# Altium project ALU_Ctrl.PrjPcb
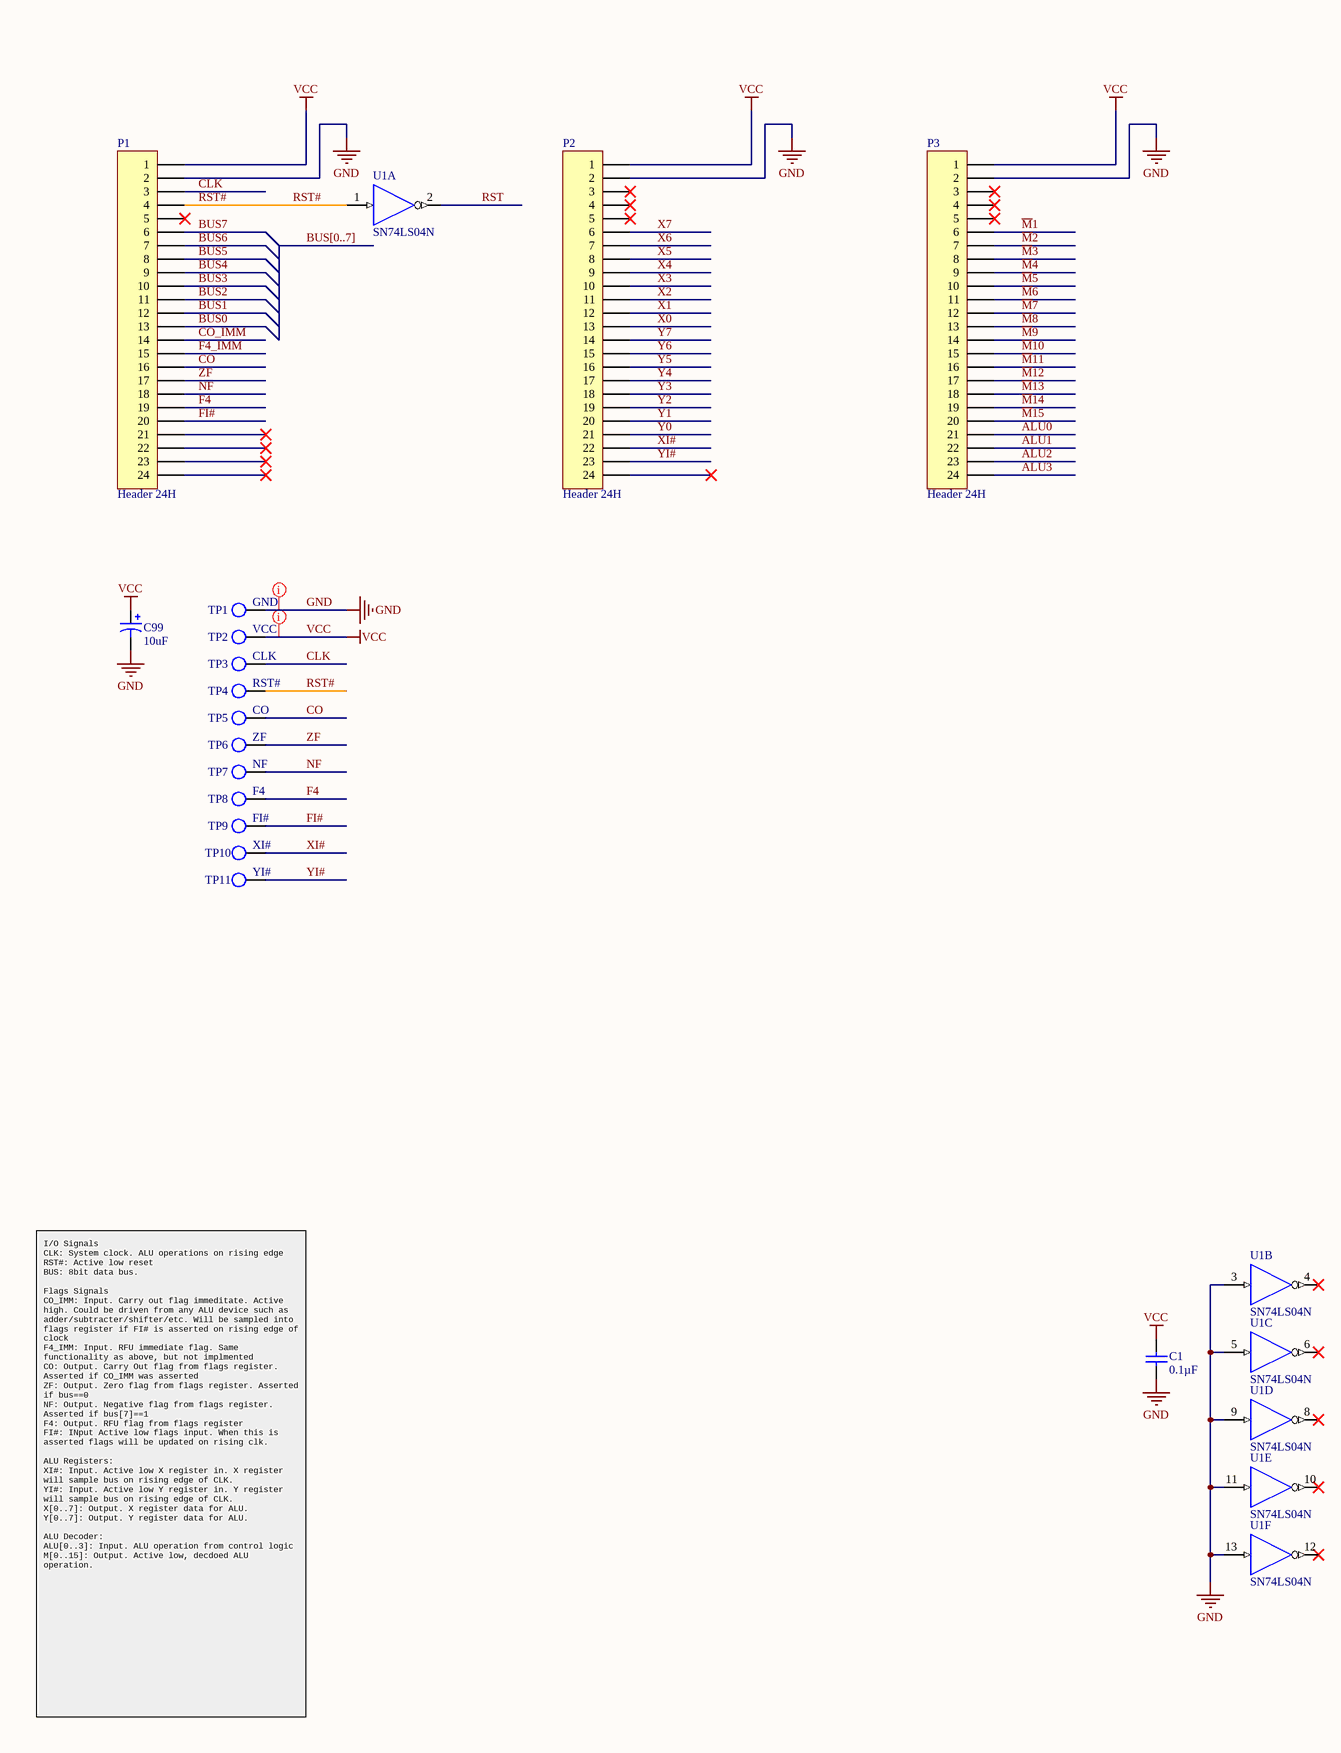
[diagram p0: ALU_Ctrl.SchDoc, left]
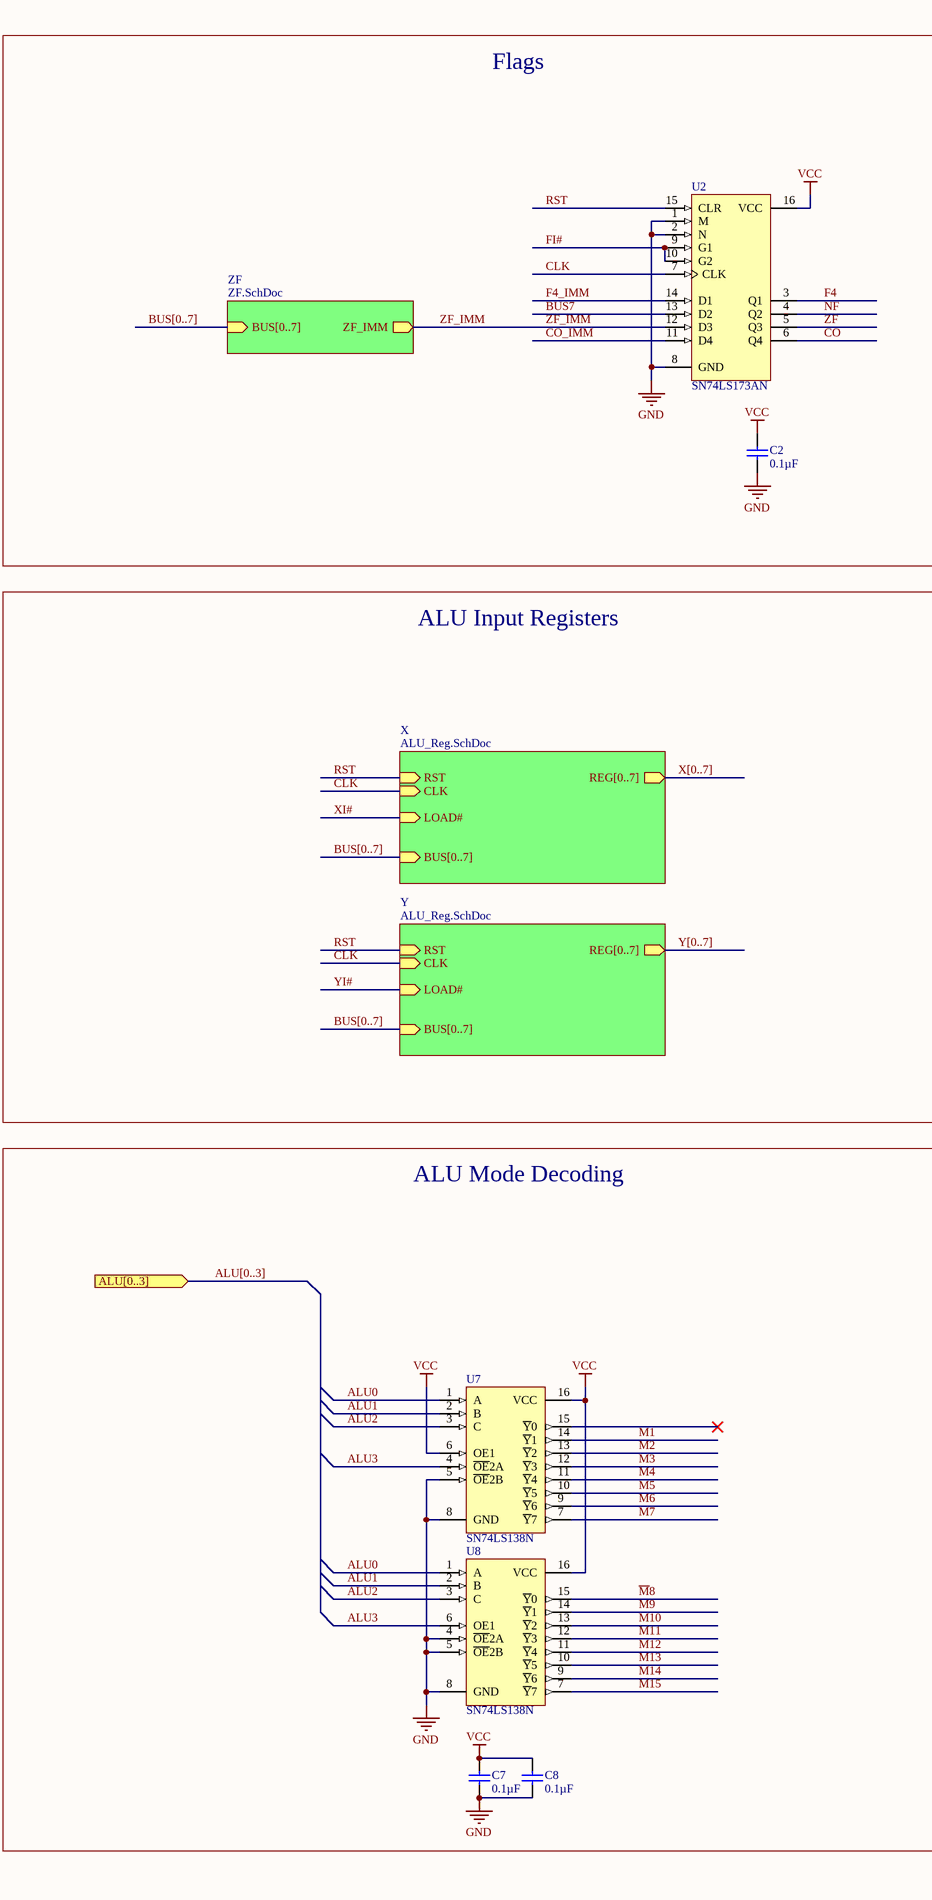
[diagram p1: ALU_Ctrl.SchDoc, right]
3 sheets, 35 parts. Net scope: hierarchical (ports join the sheet entries above them; power ports are global).
Board file: ALU_Ctrl.PcbDoc
Sheets:
  ALU_Ctrl.SchDoc
    ZF = ZF.SchDoc
    X = ALU_Reg.SchDoc
    Y = ALU_Reg.SchDoc

## Sheet ALU_Ctrl.SchDoc
size C; Author: E. Sims; Organization: Let's Build Rockets Inc.; SheetNumber: 1; SheetTotal: 3

### Parts
C1  Capacitance: 0.1µF  [VISH-K104K15X7RF5TL2]  (hidden comment: K104K15X7RF5TL2)
C2  Capacitance: 0.1µF  [VISH-K104K15X7RF5TL2]  (hidden comment: K104K15X7RF5TL2)
C7  Capacitance: 0.1µF  [VISH-K104K15X7RF5TL2]  (hidden comment: K104K15X7RF5TL2)
C8  Capacitance: 0.1µF  [VISH-K104K15X7RF5TL2]  (hidden comment: K104K15X7RF5TL2)
C99  value 10uF  [C5x7]  (hidden comment: Cap Pol5)
P1  Header 24H  [HDR1X24H]
P2  Header 24H  [HDR1X24H]
P3  Header 24H  [HDR1X24H]
TP1  GND  [KSTN-5011_V]  (no BOM)
TP2  VCC  [KSTN-5011_V]  (no BOM)
TP3  CLK  [KSTN-5011_V]  (no BOM)
TP4  RST#  [KSTN-5011_V]  (no BOM)
TP5  CO  [KSTN-5011_V]  (no BOM)
TP6  ZF  [KSTN-5011_V]  (no BOM)
TP7  NF  [KSTN-5011_V]  (no BOM)
TP8  F4  [KSTN-5011_V]  (no BOM)
TP9  FI#  [KSTN-5011_V]  (no BOM)
TP10  XI#  [KSTN-5011_V]  (no BOM)
TP11  YI#  [KSTN-5011_V]  (no BOM)
U1  SN74LS04N  [N014]  (parts A,B,C,D,E,F of 6)
U2  SN74LS173AN  [N016D]
U7  SN74LS138N  [N016]
U8  SN74LS138N  [N016]

### Blocks framed on the sheet
Flags: C2 U2
ALU Mode Decoding: C7 C8 U7 U8

### Sub-sheets
X = ALU_Reg.SchDoc: RST (in), BUS[0..7] (in), CLK (in), LOAD# (in), REG[0..7] (out)
Y = ALU_Reg.SchDoc: RST (in), BUS[0..7] (in), CLK (in), LOAD# (in), REG[0..7] (out)
ZF = ZF.SchDoc: ZF_IMM (out), BUS[0..7] (in)

### Ports
ALU[0..3] (in)

### Nets
GND: C1.2 C2.2 C7.2 C8.2 C99.2 P1.2 P2.2 P3.2 TP1.1 U1.3(A) U1.5(A) U1.7(GND) U1.9(A) U1.11(A) U1.13(A) U2.1(M) U2.2(N) U2.8(GND) U7.5(~{OE}2B) U7.8(GND) U8.4(~{OE}2A) U8.5(~{OE}2B) U8.8(GND)
VCC: C1.1 C2.1 C7.1 C8.1 C99.1 P1.1 P2.1 P3.1 TP2.1 U1.14(VCC) U2.16(VCC) U7.6(OE1) U7.16(VCC) U8.16(VCC)
ALU0: P3.21 U7.1(A) U8.1(A)
ALU1: P3.22 U7.2(B) U8.2(B)
ALU2: P3.23 U7.3(C) U8.3(C)
ALU3: P3.24 U7.4(~{OE}2A) U8.6(OE1)
BUS0: P1.13
BUS1: P1.12
BUS2: P1.11
BUS3: P1.10
BUS4: P1.9
BUS5: P1.8
BUS6: P1.7
BUS7: P1.6 U2.13(D2)
CLK: P1.3 TP3.1 U2.7(CLK) ; sheet X/CLK, sheet Y/CLK
CO: P1.16 TP5.1 U2.6(Q4)
CO_IMM: P1.14 U2.11(D4)
F4: P1.19 TP8.1 U2.3(Q1)
F4_IMM: P1.15 U2.14(D1)
FI#: P1.20 TP9.1 U2.9(G1) U2.10(G2)
~{M}1: P3.6 U7.14(~{Y}1)
~{M}2: P3.7 U7.13(~{Y}2)
~{M}3: P3.8 U7.12(~{Y}3)
~{M}4: P3.9 U7.11(~{Y}4)
~{M}5: P3.10 U7.10(~{Y}5)
~{M}6: P3.11 U7.9(~{Y}6)
~{M}7: P3.12 U7.7(~{Y}7)
~{M}8: P3.13 U8.15(~{Y}0)
~{M}9: P3.14 U8.14(~{Y}1)
~{M}10: P3.15 U8.13(~{Y}2)
~{M}11: P3.16 U8.12(~{Y}3)
~{M}12: P3.17 U8.11(~{Y}4)
~{M}13: P3.18 U8.10(~{Y}5)
~{M}14: P3.19 U8.9(~{Y}6)
~{M}15: P3.20 U8.7(~{Y}7)
NF: P1.18 TP7.1 U2.4(Q2)
RST: U1.2(Y) U2.15(CLR) ; sheet X/RST, sheet Y/RST
RST#: P1.4 TP4.1 U1.1(A)
X0: P2.13  [project net REG0]
X1: P2.12  [project net REG1]
X2: P2.11  [project net REG2]
X3: P2.10  [project net REG3]
X4: P2.9  [project net REG4]
X5: P2.8  [project net REG5]
X6: P2.7  [project net REG6]
X7: P2.6  [project net REG7]
XI#: P2.22 TP10.1 ; sheet X/LOAD#  [project net LOAD#]
Y0: P2.21  [project net REG0]
Y1: P2.20  [project net REG1]
Y2: P2.19  [project net REG2]
Y3: P2.18  [project net REG3]
Y4: P2.17  [project net REG4]
Y5: P2.16  [project net REG5]
Y6: P2.15  [project net REG6]
Y7: P2.14  [project net REG7]
YI#: P2.23 TP11.1 ; sheet Y/LOAD#  [project net LOAD#]
ZF: P1.17 TP6.1 U2.5(Q3)
ZF_IMM: U2.12(D3) ; sheet ZF/ZF_IMM

Not connected (* = marked no-connect by the designer): P1 5* 21* 22* 23* 24*; P2 3* 4* 5* 24*; P3 3* 4* 5*; U1 4(Y)* 6(Y)* 8(Y)* 10(Y)* 12(Y)*; U7 15(~{Y}0)*

### Buses and harness runs
bus ALU[0..3] = port ALU[0..3]
bus BUS[0..7]
bus BUS[0..7] = sheet X/BUS[0..7]
bus BUS[0..7] = sheet Y/BUS[0..7]
bus BUS[0..7] = sheet ZF/BUS[0..7]
bus X[0..7] = sheet X/REG[0..7]
bus Y[0..7] = sheet Y/REG[0..7]

### Layout directives
rule Width Constraint [Pref Width = 20mil    Min Width = 20mil    Max Width = 50mil]; rule Routing Via Style [Pref Size = 35mil    Pref Hole Size = 20mil]; net class PWR: GND, VCC

### Notes on the sheet
- ALU Input Registers
- I/O Signals
  CLK: System clock. ALU operations on rising edge
  RST#: Active low reset
  BUS: 8bit data bus.
  Flags Signals
  CO_IMM: Input. Carry out flag immeditate. Active high. Could be driven from any ALU device such as adder/subtracter/shifter/etc. Will be sampled into flags register if FI# is asserted on rising edge of clock
  F4_IMM: Input. RFU immediate flag. Same functionality as above, but not implmented
  CO: Output. Carry Out flag from flags register. Asserted if CO_IMM was asserted
  ZF: Output. Zero flag from flags register. Asserted if bus==0
  NF: Output. Negative flag from flags register. Asserted if bus[7]==1
  F4: Output. RFU flag from flags register
  FI#: INput Active low flags input. When this is asserted flags will be updated on rising clk.
  ALU Registers:
  XI#: Input. Active low X register in. X register will sample bus on rising edge of CLK.
  YI#: Input. Active low Y register in. Y register will sample bus on rising edge of CLK.
  X[0..7]: Output. X register data for ALU.
  Y[0..7]: Output. Y register data for ALU.
  ALU Decoder:
  ALU[0..3]: Input. ALU operation from control logic
  M[0..15]: Output. Active low, decdoed ALU operation.
- Let's Build Rocket's Inc. Modular Paylaod System Based on TMP-010 Rev
  For more information visit https://github.com/LetsBuildRockets/Modular-Payload-System
  This work is licensed under CC BY-NC 4.0. To view a copy of this license, visit https://creativecommons.org/licenses/by-nc/4.0
- Title
- Size:
- Date:
- Assembly Variant:
- B
- Number:
- Time:
- Revision:
- Sheet
- of
- Author:
- File:

### Library data of the parts
C1 C2 C7 C8 = CMP-2000-06508-1: Ceramic Capacitor, 100 nF, +/- 10%, 50 V, -55 to 125 degC, 2-Pin THD, RoHS, Tape and Reel; Manufacturer: Vishay; Other Names: BC1084CT; Catalog Drawings: Mono-KapSide2-15_5.58Mono-KapSide1_15; Temperature Coefficient: X7R; Voltage - Rated: 50V; Online Catalog: Mono-Kap™Series; Size / Dimension: 0.157"Lx0.098"W(4.00mmx2.50mm); Operating Temperature: -55°C~125°C; Family: CeramicCapacitors; Manufacturer URL: http://www.vishay.com/; Standard Package: 1; Thickness (Max): -; Ratings: -; Datasheet Version: 08/2013; Package Description: 2-Pin Through Hole Device, Body 4 x 2.6 mm; Mounting Type: ThroughHole; Features: -; Lead Spacing: 0.098"(2.50mm); Tolerance: ±10%; Category: Capacitors; Mounting Technology: ThroughHole; Lead Style: Straight; Datasheet URL: http://www.vishay.com/docs/45171/kseries.pdf; Applications: GeneralPurpose; Package / Case: Radial; Height - Seated (Max): 0.220"(5.58mm); Package Reference: K104K15X7RF5TL2; Series: Mono-Kap™K; Packaging: CutTape(CT)
C99 = Cap Pol5: Polarized Capacitor; Published: 8-Jun-2000; LatestRevisionDate: 17-Jul-2002; LatestRevisionNote: Re-released for DXP Platform.; PackageReference: POLAR0.8; Publisher: Altium Limited; PackageDescription: Polarized Capacitor; 2 Leads
P1-P3 = Header 24H: Header, 24-Pin, Right Angle; System: Connector; LatestRevisionDate: 17-Jul-2002; LatestRevisionNote: Re-released for DXP Platform.; Publisher: Altium Limited
TP1-TP11 = TP
U1 = SN74LS04N: Hex Inverter; Published: 8-Jun-2000; LatestRevisionDate: 04-Mar-2005; LatestRevisionNote: Stylized 3D Model Added.; DatasheetVersion: Mar-1988; PackageVersion: Oct-1995; PackageReference: N014; Publisher: Altium Limited; PackageDescription: DIP; 14 Leads; Row Spacing 7.62 mm; Pitch 2.54 mm; ComponentLink1Description: Manufacturer Link; ComponentLink1URL: http://www.ti.com/; ComponentLink2Description: Datasheet; ComponentLink2URL: http://www-s.ti.com/sc/ds/sn74ls04.pdf
U2 = SN74LS173AN: 4-Bit D-Type Register with 3-State Outputs; Published: 8-Jun-2000; LatestRevisionDate: 04-Mar-2005; LatestRevisionNote: Stylized 3D Model Added.; DatasheetVersion: Mar-1988; PackageVersion: Oct-1995; PackageReference: N016D; Publisher: Altium Limited; PackageDescription: DIP; 16 Leads; Row Spacing 7.62 mm; Pitch 2.54 mm; Code_JEDEC: MS-001-BB; ComponentLink1Description: Manufacturer Link; ComponentLink1URL: http://www.ti.com/; ComponentLink2Description: Datasheet; ComponentLink2URL: http://www-s.ti.com/sc/ds/sn74ls173a.pdf
U7 U8 = SN74LS138N: 3-Line to 8-Line Decoder / Demultiplexer; Published: 8-Jun-2000; LatestRevisionDate: 04-Mar-2005; LatestRevisionNote: Stylized 3D Model Added.; DatasheetVersion: Mar-1988; PackageVersion: Oct-1995; PackageReference: N016; Publisher: Altium Limited; PackageDescription: DIP; 16 Leads; Row Spacing 7.62 mm; Pitch 2.54 mm; Code_JEDEC: MS-001-BB; ComponentLink1Description: Manufacturer Link; ComponentLink1URL: http://www.ti.com/; ComponentLink2Description: Datasheet; ComponentLink2URL: http://www-s.ti.com/sc/ds/sn74ls138.pdf

## Sheet ZF.SchDoc
size A; Author: E. Sims; Organization: Let's Build Rockets Inc.; SheetNumber: 2; SheetTotal: 3
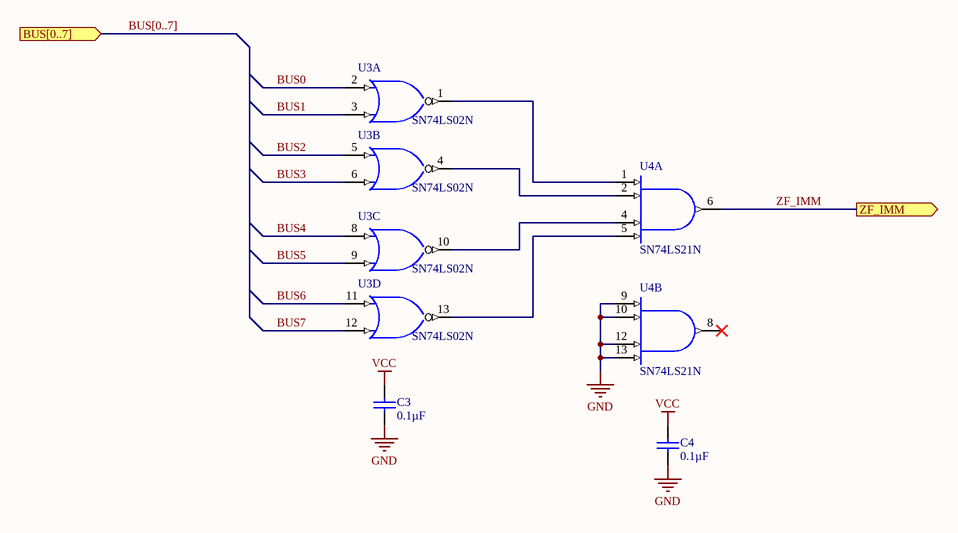
[diagram p2: ZF.SchDoc]

### Parts
C3  Capacitance: 0.1µF  [VISH-K104K15X7RF5TL2]  (hidden comment: K104K15X7RF5TL2)
C4  Capacitance: 0.1µF  [VISH-K104K15X7RF5TL2]  (hidden comment: K104K15X7RF5TL2)
U3  SN74LS02N  [N014]  (parts A,B,C,D of 4)
U4  SN74LS21N  [N014]  (parts A,B of 2)

### Ports
BUS[0..7] (in), ZF_IMM (out)

### Nets
GND: C3.2 C4.2 U3.7(GND) U4.7(GND) U4.9(A) U4.10(B) U4.12(C) U4.13(D)
VCC: C3.1 C4.1 U3.14(VCC) U4.14(VCC)
BUS0: U3.2(A)
BUS1: U3.3(B)
BUS2: U3.5(A)
BUS3: U3.6(B)
BUS4: U3.8(A)
BUS5: U3.9(B)
BUS6: U3.11(A)
BUS7: U3.12(B)
ZF_IMM: U4.6(Y) ; port ZF_IMM
NetU3_1: U3.1(Y) U4.1(A)
NetU3_4: U3.4(Y) U4.2(B)
NetU3_10: U3.10(Y) U4.4(C)
NetU3_13: U3.13(Y) U4.5(D)

Not connected (* = marked no-connect by the designer): U4 8(Y)*

### Buses and harness runs
bus BUS[0..7] = port BUS[0..7]

### Notes on the sheet
- Let's Build Rocket's Inc. Modular Paylaod System Based on TMP-010 Rev
  For more information visit https://github.com/LetsBuildRockets/Modular-Payload-System
  This work is licensed under CC BY-NC 4.0. To view a copy of this license, visit https://creativecommons.org/licenses/by-nc/4.0
- Title
- Size:
- Date:
- Assembly Variant:
- B
- Number:
- Time:
- Revision:
- Sheet
- of
- Author:
- File:

### Library data of the parts
C3 C4 = CMP-2000-06508-1: as C1 on sheet ALU_Ctrl; Size / Dimension: 0.157"Lx0.098"W(4.00mmx2.50mm); Operating Temperature: -55°C~125°C; Family: CeramicCapacitors; Manufacturer URL: http://www.vishay.com/; Standard Package: 1; Thickness (Max): -; Ratings: -; Datasheet Version: 08/2013; Package Description: 2-Pin Through Hole Device, Body 4 x 2.6 mm; Mounting Type: ThroughHole; Features: -; Lead Spacing: 0.098"(2.50mm); Tolerance: ±10%; Category: Capacitors; Mounting Technology: ThroughHole; Lead Style: Straight; Datasheet URL: http://www.vishay.com/docs/45171/kseries.pdf; Applications: GeneralPurpose; Package / Case: Radial; Height - Seated (Max): 0.220"(5.58mm); Package Reference: K104K15X7RF5TL2; Series: Mono-Kap™K; Packaging: CutTape(CT)
U3 = SN74LS02N: Quadruple 2-Input Positive-NOR Gate; Published: 8-Jun-2000; LatestRevisionDate: 04-Mar-2005; LatestRevisionNote: Stylized 3D Model Added.; DatasheetVersion: Mar-1988; PackageVersion: Oct-1995; PackageReference: N014; Publisher: Altium Limited; PackageDescription: DIP; 14 Leads; Row Spacing 7.62 mm; Pitch 2.54 mm; ComponentLink1Description: Manufacturer Link; ComponentLink1URL: http://www.ti.com/; ComponentLink2Description: Datasheet; ComponentLink2URL: http://www-s.ti.com/sc/ds/sn54s02.pdf
U4 = SN74LS21N: Dual 4-Input Positive-AND Gate; Note: Pins 3 and 11 are NC & not drawn.; Published: 8-Jun-2000; LatestRevisionDate: 04-Mar-2005; LatestRevisionNote: Stylized 3D Model Added.; DatasheetVersion: Mar-1988; PackageVersion: Oct-1995; PackageReference: N014; Publisher: Altium Limited; PackageDescription: DIP; 14 Leads; Row Spacing 7.62 mm; Pitch 2.54 mm; ComponentLink1Description: Manufacturer Link; ComponentLink1URL: http://www.ti.com/; ComponentLink2Description: Datasheet; ComponentLink2URL: http://www-s.ti.com/sc/ds/SN74LS21.pdf

## Sheet ALU_Reg.SchDoc
size B; Author: E. Sims; Organization: Let's Build Rockets Inc.; SheetNumber: 3; SheetTotal: 3
Used 2 times, as channels X, Y. Parts and nets are listed once, with the designators drawn on the sheet.
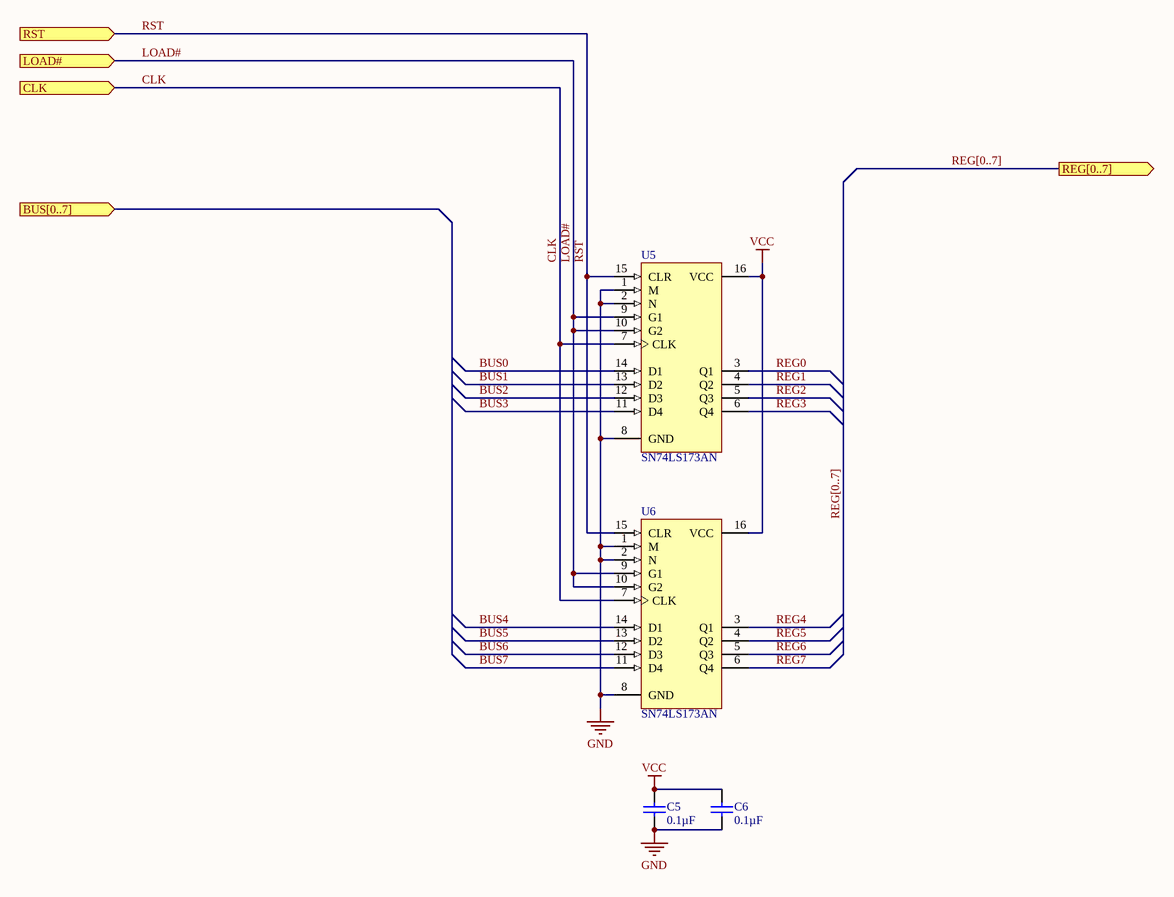
[diagram p3: ALU_Reg.SchDoc]

### Parts
C5  Capacitance: 0.1µF  [VISH-K104K15X7RF5TL2]  (hidden comment: K104K15X7RF5TL2)
C6  Capacitance: 0.1µF  [VISH-K104K15X7RF5TL2]  (hidden comment: K104K15X7RF5TL2)
U5  SN74LS173AN  [N016D]
U6  SN74LS173AN  [N016D]

### Ports
BUS[0..7] (in), CLK (in), LOAD# (in), REG[0..7] (out), RST (in)

### Nets
GND: C5.2 C6.2 U5.1(M) U5.2(N) U5.8(GND) U6.1(M) U6.2(N) U6.8(GND)
VCC: C5.1 C6.1 U5.16(VCC) U6.16(VCC)
BUS0: U5.14(D1)
BUS1: U5.13(D2)
BUS2: U5.12(D3)
BUS3: U5.11(D4)
BUS4: U6.14(D1)
BUS5: U6.13(D2)
BUS6: U6.12(D3)
BUS7: U6.11(D4)
CLK: U5.7(CLK) U6.7(CLK) ; port CLK
LOAD#: U5.9(G1) U5.10(G2) U6.9(G1) U6.10(G2) ; port LOAD#
REG0: U5.3(Q1)
REG1: U5.4(Q2)
REG2: U5.5(Q3)
REG3: U5.6(Q4)
REG4: U6.3(Q1)
REG5: U6.4(Q2)
REG6: U6.5(Q3)
REG7: U6.6(Q4)
RST: U5.15(CLR) U6.15(CLR) ; port RST

### Channels
X: designators end in _X; ports CLK=CLK LOAD#=LOAD# RST=RST
Y: designators end in _Y; ports CLK=CLK LOAD#=LOAD# RST=RST

### Buses and harness runs
bus REG[0..7] = port REG[0..7]

### Notes on the sheet
- Let's Build Rocket's Inc. Modular Paylaod System Based on TMP-010 Rev
  For more information visit https://github.com/LetsBuildRockets/Modular-Payload-System
  This work is licensed under CC BY-NC 4.0. To view a copy of this license, visit https://creativecommons.org/licenses/by-nc/4.0
- Title
- Size:
- Date:
- Assembly Variant:
- B
- Number:
- Time:
- Revision:
- Sheet
- of
- Author:
- File:

### Library data of the parts
C5 C6 = CMP-2000-06508-1: as C1 on sheet ALU_Ctrl; Size / Dimension: 0.157"Lx0.098"W(4.00mmx2.50mm); Operating Temperature: -55°C~125°C; Family: CeramicCapacitors; Manufacturer URL: http://www.vishay.com/; Standard Package: 1; Thickness (Max): -; Ratings: -; Datasheet Version: 08/2013; Package Description: 2-Pin Through Hole Device, Body 4 x 2.6 mm; Mounting Type: ThroughHole; Features: -; Lead Spacing: 0.098"(2.50mm); Tolerance: ±10%; Category: Capacitors; Mounting Technology: ThroughHole; Lead Style: Straight; Datasheet URL: http://www.vishay.com/docs/45171/kseries.pdf; Applications: GeneralPurpose; Package / Case: Radial; Height - Seated (Max): 0.220"(5.58mm); Package Reference: K104K15X7RF5TL2; Series: Mono-Kap™K; Packaging: CutTape(CT)
U5 U6 = SN74LS173AN: as U2 on sheet ALU_Ctrl; Published: 8-Jun-2000; LatestRevisionDate: 04-Mar-2005; LatestRevisionNote: Stylized 3D Model Added.; DatasheetVersion: Mar-1988; PackageVersion: Oct-1995; PackageReference: N016D; Publisher: Altium Limited; PackageDescription: DIP; 16 Leads; Row Spacing 7.62 mm; Pitch 2.54 mm; Code_JEDEC: MS-001-BB; ComponentLink1Description: Manufacturer Link; ComponentLink1URL: http://www.ti.com/; ComponentLink2Description: Datasheet; ComponentLink2URL: http://www-s.ti.com/sc/ds/sn74ls173a.pdf

## Nets that join several sheets
GND: ALU_Ctrl (23 pins), ZF (8 pins), X (8 pins), Y (8 pins)
VCC: ALU_Ctrl (14 pins), ZF (C3.1 C4.1 U3.14 U4.14), X (C5_X.1 C6_X.1 U5_X.16 U6_X.16), Y (C5_Y.1 C6_Y.1 U5_Y.16 U6_Y.16)
BUS0: ALU_Ctrl (P1.13), ZF (U3.2)
BUS1: ALU_Ctrl (P1.12), ZF (U3.3)
BUS2: ALU_Ctrl (P1.11), ZF (U3.5)
BUS3: ALU_Ctrl (P1.10), ZF (U3.6)
BUS4: ALU_Ctrl (P1.9), ZF (U3.8)
BUS5: ALU_Ctrl (P1.8), ZF (U3.9)
BUS6: ALU_Ctrl (P1.7), ZF (U3.11)
BUS7: ALU_Ctrl (P1.6 U2.13), ZF (U3.12)
CLK: ALU_Ctrl (P1.3 TP3.1 U2.7), X (U5_X.7 U6_X.7), Y (U5_Y.7 U6_Y.7)
LOAD#: ALU_Ctrl (P2.22 TP10.1), X (U5_X.9 U5_X.10 U6_X.9 U6_X.10)
LOAD#: ALU_Ctrl (P2.23 TP11.1), Y (U5_Y.9 U5_Y.10 U6_Y.9 U6_Y.10)
REG0: ALU_Ctrl (P2.13), X (U5_X.3)
REG0: ALU_Ctrl (P2.21), Y (U5_Y.3)
REG1: ALU_Ctrl (P2.12), X (U5_X.4)
REG1: ALU_Ctrl (P2.20), Y (U5_Y.4)
REG2: ALU_Ctrl (P2.11), X (U5_X.5)
REG2: ALU_Ctrl (P2.19), Y (U5_Y.5)
REG3: ALU_Ctrl (P2.10), X (U5_X.6)
REG3: ALU_Ctrl (P2.18), Y (U5_Y.6)
REG4: ALU_Ctrl (P2.9), X (U6_X.3)
REG4: ALU_Ctrl (P2.17), Y (U6_Y.3)
REG5: ALU_Ctrl (P2.8), X (U6_X.4)
REG5: ALU_Ctrl (P2.16), Y (U6_Y.4)
REG6: ALU_Ctrl (P2.7), X (U6_X.5)
REG6: ALU_Ctrl (P2.15), Y (U6_Y.5)
REG7: ALU_Ctrl (P2.6), X (U6_X.6)
REG7: ALU_Ctrl (P2.14), Y (U6_Y.6)
RST: ALU_Ctrl (U1.2 U2.15), X (U5_X.15 U6_X.15), Y (U5_Y.15 U6_Y.15)
ZF_IMM: ALU_Ctrl (U2.12), ZF (U4.6)